# Altium project Project-C_VOLTAGE.PrjPCB (part 4 of 6)
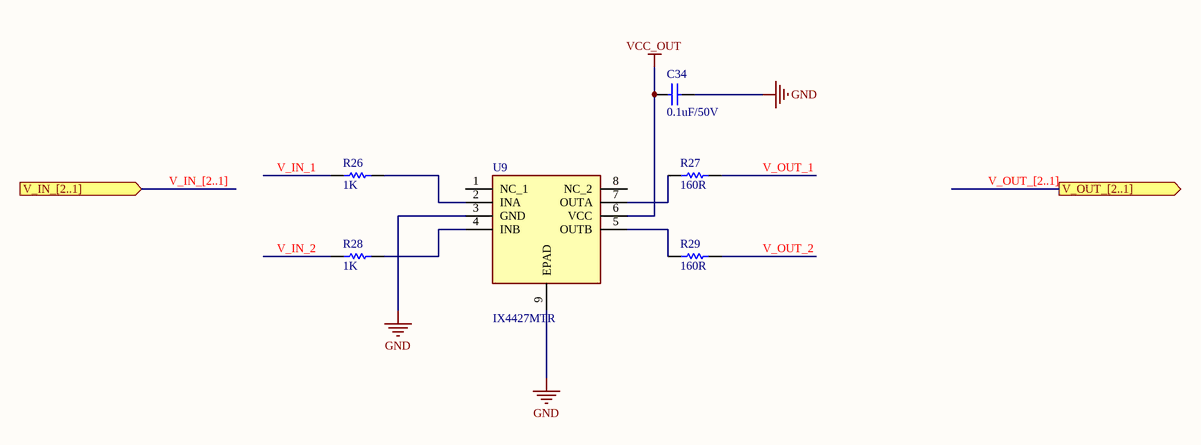
[diagram p11: VoltageAmplifier.SchDoc]

## Nets that join several sheets (continued)
VCC_OUT: POWER_VOLTAGE (6 pins), U_VoltageAmplifier_1xFPGA1/U_VoltageAmplifier1 (C34_U_VoltageAmplifier_1xFPGA1_U_VoltageAmplifier1.1 U9_U_VoltageAmplifier_1xFPGA1_U_VoltageAmplifier1.6), U_VoltageAmplifier_1xFPGA1/U_VoltageAmplifier2 (C34_U_VoltageAmplifier_1xFPGA1_U_VoltageAmplifier2.1 U9_U_VoltageAmplifier_1xFPGA1_U_VoltageAmplifier2.6), U_VoltageAmplifier_1xFPGA1/U_VoltageAmplifier3 (C34_U_VoltageAmplifier_1xFPGA1_U_VoltageAmplifier3.1 U9_U_VoltageAmplifier_1xFPGA1_U_VoltageAmplifier3.6), U_VoltageAmplifier_1xFPGA1/U_VoltageAmplifier4 (C34_U_VoltageAmplifier_1xFPGA1_U_VoltageAmplifier4.1 U9_U_VoltageAmplifier_1xFPGA1_U_VoltageAmplifier4.6), U_VoltageAmplifier_1xFPGA1/U_VoltageAmplifier5 (C34_U_VoltageAmplifier_1xFPGA1_U_VoltageAmplifier5.1 U9_U_VoltageAmplifier_1xFPGA1_U_VoltageAmplifier5.6), U_VoltageAmplifier_1xFPGA1/U_VoltageAmplifier6 (C34_U_VoltageAmplifier_1xFPGA1_U_VoltageAmplifier6.1 U9_U_VoltageAmplifier_1xFPGA1_U_VoltageAmplifier6.6), U_VoltageAmplifier_1xFPGA1/U_VoltageAmplifier7 (C34_U_VoltageAmplifier_1xFPGA1_U_VoltageAmplifier7.1 U9_U_VoltageAmplifier_1xFPGA1_U_VoltageAmplifier7.6), U_VoltageAmplifier_1xFPGA1/U_VoltageAmplifier8 (C34_U_VoltageAmplifier_1xFPGA1_U_VoltageAmplifier8.1 U9_U_VoltageAmplifier_1xFPGA1_U_VoltageAmplifier8.6), U_VoltageAmplifier_1xFPGA1/U_VoltageAmplifier9 (C34_U_VoltageAmplifier_1xFPGA1_U_VoltageAmplifier9.1 U9_U_VoltageAmplifier_1xFPGA1_U_VoltageAmplifier9.6), U_VoltageAmplifier_1xFPGA1/U_VoltageAmplifier10 (C34_U_VoltageAmplifier_1xFPGA1_U_VoltageAmplifier10.1 U9_U_VoltageAmplifier_1xFPGA1_U_VoltageAmplifier10.6), U_VoltageAmplifier_1xFPGA1/U_VoltageAmplifier11 (C34_U_VoltageAmplifier_1xFPGA1_U_VoltageAmplifier11.1 U9_U_VoltageAmplifier_1xFPGA1_U_VoltageAmplifier11.6), U_VoltageAmplifier_1xFPGA1/U_VoltageAmplifier12 (C34_U_VoltageAmplifier_1xFPGA1_U_VoltageAmplifier12.1 U9_U_VoltageAmplifier_1xFPGA1_U_VoltageAmplifier12.6), U_VoltageAmplifier_1xFPGA1/U_VoltageAmplifier13 (C34_U_VoltageAmplifier_1xFPGA1_U_VoltageAmplifier13.1 U9_U_VoltageAmplifier_1xFPGA1_U_VoltageAmplifier13.6), U_VoltageAmplifier_1xFPGA1/U_VoltageAmplifier14 (C34_U_VoltageAmplifier_1xFPGA1_U_VoltageAmplifier14.1 U9_U_VoltageAmplifier_1xFPGA1_U_VoltageAmplifier14.6), U_VoltageAmplifier_1xFPGA1/U_VoltageAmplifier15 (C34_U_VoltageAmplifier_1xFPGA1_U_VoltageAmplifier15.1 U9_U_VoltageAmplifier_1xFPGA1_U_VoltageAmplifier15.6), U_VoltageAmplifier_1xFPGA1/U_VoltageAmplifier16 (C34_U_VoltageAmplifier_1xFPGA1_U_VoltageAmplifier16.1 U9_U_VoltageAmplifier_1xFPGA1_U_VoltageAmplifier16.6), U_VoltageAmplifier_1xFPGA1/U_VoltageAmplifier17 (C34_U_VoltageAmplifier_1xFPGA1_U_VoltageAmplifier17.1 U9_U_VoltageAmplifier_1xFPGA1_U_VoltageAmplifier17.6), U_VoltageAmplifier_1xFPGA1/U_VoltageAmplifier18 (C34_U_VoltageAmplifier_1xFPGA1_U_VoltageAmplifier18.1 U9_U_VoltageAmplifier_1xFPGA1_U_VoltageAmplifier18.6), U_VoltageAmplifier_1xFPGA1/U_VoltageAmplifier19 (C34_U_VoltageAmplifier_1xFPGA1_U_VoltageAmplifier19.1 U9_U_VoltageAmplifier_1xFPGA1_U_VoltageAmplifier19.6), U_VoltageAmplifier_1xFPGA1/U_VoltageAmplifier20 (C34_U_VoltageAmplifier_1xFPGA1_U_VoltageAmplifier20.1 U9_U_VoltageAmplifier_1xFPGA1_U_VoltageAmplifier20.6), U_VoltageAmplifier_1xFPGA1/U_VoltageAmplifier21 (C34_U_VoltageAmplifier_1xFPGA1_U_VoltageAmplifier21.1 U9_U_VoltageAmplifier_1xFPGA1_U_VoltageAmplifier21.6), U_VoltageAmplifier_1xFPGA1/U_VoltageAmplifier22 (C34_U_VoltageAmplifier_1xFPGA1_U_VoltageAmplifier22.1 U9_U_VoltageAmplifier_1xFPGA1_U_VoltageAmplifier22.6), U_VoltageAmplifier_1xFPGA1/U_VoltageAmplifier23 (C34_U_VoltageAmplifier_1xFPGA1_U_VoltageAmplifier23.1 U9_U_VoltageAmplifier_1xFPGA1_U_VoltageAmplifier23.6), U_VoltageAmplifier_1xFPGA1/U_VoltageAmplifier24 (C34_U_VoltageAmplifier_1xFPGA1_U_VoltageAmplifier24.1 U9_U_VoltageAmplifier_1xFPGA1_U_VoltageAmplifier24.6), U_VoltageAmplifier_1xFPGA1/U_VoltageAmplifier25 (C34_U_VoltageAmplifier_1xFPGA1_U_VoltageAmplifier25.1 U9_U_VoltageAmplifier_1xFPGA1_U_VoltageAmplifier25.6), U_VoltageAmplifier_1xFPGA1/U_VoltageAmplifier26 (C34_U_VoltageAmplifier_1xFPGA1_U_VoltageAmplifier26.1 U9_U_VoltageAmplifier_1xFPGA1_U_VoltageAmplifier26.6), U_VoltageAmplifier_1xFPGA1/U_VoltageAmplifier27 (C34_U_VoltageAmplifier_1xFPGA1_U_VoltageAmplifier27.1 U9_U_VoltageAmplifier_1xFPGA1_U_VoltageAmplifier27.6), U_VoltageAmplifier_1xFPGA1/U_VoltageAmplifier28 (C34_U_VoltageAmplifier_1xFPGA1_U_VoltageAmplifier28.1 U9_U_VoltageAmplifier_1xFPGA1_U_VoltageAmplifier28.6), U_VoltageAmplifier_1xFPGA1/U_VoltageAmplifier29 (C34_U_VoltageAmplifier_1xFPGA1_U_VoltageAmplifier29.1 U9_U_VoltageAmplifier_1xFPGA1_U_VoltageAmplifier29.6), U_VoltageAmplifier_1xFPGA1/U_VoltageAmplifier30 (C34_U_VoltageAmplifier_1xFPGA1_U_VoltageAmplifier30.1 U9_U_VoltageAmplifier_1xFPGA1_U_VoltageAmplifier30.6), U_VoltageAmplifier_1xFPGA1/U_VoltageAmplifier31 (C34_U_VoltageAmplifier_1xFPGA1_U_VoltageAmplifier31.1 U9_U_VoltageAmplifier_1xFPGA1_U_VoltageAmplifier31.6), U_VoltageAmplifier_1xFPGA1/U_VoltageAmplifier32 (C34_U_VoltageAmplifier_1xFPGA1_U_VoltageAmplifier32.1 U9_U_VoltageAmplifier_1xFPGA1_U_VoltageAmplifier32.6), U_VoltageAmplifier_1xFPGA1/U_VoltageAmplifier33 (C34_U_VoltageAmplifier_1xFPGA1_U_VoltageAmplifier33.1 U9_U_VoltageAmplifier_1xFPGA1_U_VoltageAmplifier33.6), U_VoltageAmplifier_1xFPGA1/U_VoltageAmplifier34 (C34_U_VoltageAmplifier_1xFPGA1_U_VoltageAmplifier34.1 U9_U_VoltageAmplifier_1xFPGA1_U_VoltageAmplifier34.6), U_VoltageAmplifier_1xFPGA1/U_VoltageAmplifier35 (C34_U_VoltageAmplifier_1xFPGA1_U_VoltageAmplifier35.1 U9_U_VoltageAmplifier_1xFPGA1_U_VoltageAmplifier35.6), U_VoltageAmplifier_1xFPGA1/U_VoltageAmplifier36 (C34_U_VoltageAmplifier_1xFPGA1_U_VoltageAmplifier36.1 U9_U_VoltageAmplifier_1xFPGA1_U_VoltageAmplifier36.6), U_VoltageAmplifier_1xFPGA1/U_VoltageAmplifier37 (C34_U_VoltageAmplifier_1xFPGA1_U_VoltageAmplifier37.1 U9_U_VoltageAmplifier_1xFPGA1_U_VoltageAmplifier37.6), U_VoltageAmplifier_1xFPGA1/U_VoltageAmplifier38 (C34_U_VoltageAmplifier_1xFPGA1_U_VoltageAmplifier38.1 U9_U_VoltageAmplifier_1xFPGA1_U_VoltageAmplifier38.6), U_VoltageAmplifier_1xFPGA2/U_VoltageAmplifier1 (C34_U_VoltageAmplifier_1xFPGA2_U_VoltageAmplifier1.1 U9_U_VoltageAmplifier_1xFPGA2_U_VoltageAmplifier1.6), U_VoltageAmplifier_1xFPGA2/U_VoltageAmplifier2 (C34_U_VoltageAmplifier_1xFPGA2_U_VoltageAmplifier2.1 U9_U_VoltageAmplifier_1xFPGA2_U_VoltageAmplifier2.6), U_VoltageAmplifier_1xFPGA2/U_VoltageAmplifier3 (C34_U_VoltageAmplifier_1xFPGA2_U_VoltageAmplifier3.1 U9_U_VoltageAmplifier_1xFPGA2_U_VoltageAmplifier3.6), U_VoltageAmplifier_1xFPGA2/U_VoltageAmplifier4 (C34_U_VoltageAmplifier_1xFPGA2_U_VoltageAmplifier4.1 U9_U_VoltageAmplifier_1xFPGA2_U_VoltageAmplifier4.6), U_VoltageAmplifier_1xFPGA2/U_VoltageAmplifier5 (C34_U_VoltageAmplifier_1xFPGA2_U_VoltageAmplifier5.1 U9_U_VoltageAmplifier_1xFPGA2_U_VoltageAmplifier5.6), U_VoltageAmplifier_1xFPGA2/U_VoltageAmplifier6 (C34_U_VoltageAmplifier_1xFPGA2_U_VoltageAmplifier6.1 U9_U_VoltageAmplifier_1xFPGA2_U_VoltageAmplifier6.6), U_VoltageAmplifier_1xFPGA2/U_VoltageAmplifier7 (C34_U_VoltageAmplifier_1xFPGA2_U_VoltageAmplifier7.1 U9_U_VoltageAmplifier_1xFPGA2_U_VoltageAmplifier7.6), U_VoltageAmplifier_1xFPGA2/U_VoltageAmplifier8 (C34_U_VoltageAmplifier_1xFPGA2_U_VoltageAmplifier8.1 U9_U_VoltageAmplifier_1xFPGA2_U_VoltageAmplifier8.6), U_VoltageAmplifier_1xFPGA2/U_VoltageAmplifier9 (C34_U_VoltageAmplifier_1xFPGA2_U_VoltageAmplifier9.1 U9_U_VoltageAmplifier_1xFPGA2_U_VoltageAmplifier9.6), U_VoltageAmplifier_1xFPGA2/U_VoltageAmplifier10 (C34_U_VoltageAmplifier_1xFPGA2_U_VoltageAmplifier10.1 U9_U_VoltageAmplifier_1xFPGA2_U_VoltageAmplifier10.6), U_VoltageAmplifier_1xFPGA2/U_VoltageAmplifier11 (C34_U_VoltageAmplifier_1xFPGA2_U_VoltageAmplifier11.1 U9_U_VoltageAmplifier_1xFPGA2_U_VoltageAmplifier11.6), U_VoltageAmplifier_1xFPGA2/U_VoltageAmplifier12 (C34_U_VoltageAmplifier_1xFPGA2_U_VoltageAmplifier12.1 U9_U_VoltageAmplifier_1xFPGA2_U_VoltageAmplifier12.6), U_VoltageAmplifier_1xFPGA2/U_VoltageAmplifier13 (C34_U_VoltageAmplifier_1xFPGA2_U_VoltageAmplifier13.1 U9_U_VoltageAmplifier_1xFPGA2_U_VoltageAmplifier13.6), U_VoltageAmplifier_1xFPGA2/U_VoltageAmplifier14 (C34_U_VoltageAmplifier_1xFPGA2_U_VoltageAmplifier14.1 U9_U_VoltageAmplifier_1xFPGA2_U_VoltageAmplifier14.6), U_VoltageAmplifier_1xFPGA2/U_VoltageAmplifier15 (C34_U_VoltageAmplifier_1xFPGA2_U_VoltageAmplifier15.1 U9_U_VoltageAmplifier_1xFPGA2_U_VoltageAmplifier15.6), U_VoltageAmplifier_1xFPGA2/U_VoltageAmplifier16 (C34_U_VoltageAmplifier_1xFPGA2_U_VoltageAmplifier16.1 U9_U_VoltageAmplifier_1xFPGA2_U_VoltageAmplifier16.6), U_VoltageAmplifier_1xFPGA2/U_VoltageAmplifier17 (C34_U_VoltageAmplifier_1xFPGA2_U_VoltageAmplifier17.1 U9_U_VoltageAmplifier_1xFPGA2_U_VoltageAmplifier17.6), U_VoltageAmplifier_1xFPGA2/U_VoltageAmplifier18 (C34_U_VoltageAmplifier_1xFPGA2_U_VoltageAmplifier18.1 U9_U_VoltageAmplifier_1xFPGA2_U_VoltageAmplifier18.6), U_VoltageAmplifier_1xFPGA2/U_VoltageAmplifier19 (C34_U_VoltageAmplifier_1xFPGA2_U_VoltageAmplifier19.1 U9_U_VoltageAmplifier_1xFPGA2_U_VoltageAmplifier19.6), U_VoltageAmplifier_1xFPGA2/U_VoltageAmplifier20 (C34_U_VoltageAmplifier_1xFPGA2_U_VoltageAmplifier20.1 U9_U_VoltageAmplifier_1xFPGA2_U_VoltageAmplifier20.6), U_VoltageAmplifier_1xFPGA2/U_VoltageAmplifier21 (C34_U_VoltageAmplifier_1xFPGA2_U_VoltageAmplifier21.1 U9_U_VoltageAmplifier_1xFPGA2_U_VoltageAmplifier21.6), U_VoltageAmplifier_1xFPGA2/U_VoltageAmplifier22 (C34_U_VoltageAmplifier_1xFPGA2_U_VoltageAmplifier22.1 U9_U_VoltageAmplifier_1xFPGA2_U_VoltageAmplifier22.6), U_VoltageAmplifier_1xFPGA2/U_VoltageAmplifier23 (C34_U_VoltageAmplifier_1xFPGA2_U_VoltageAmplifier23.1 U9_U_VoltageAmplifier_1xFPGA2_U_VoltageAmplifier23.6), U_VoltageAmplifier_1xFPGA2/U_VoltageAmplifier24 (C34_U_VoltageAmplifier_1xFPGA2_U_VoltageAmplifier24.1 U9_U_VoltageAmplifier_1xFPGA2_U_VoltageAmplifier24.6), U_VoltageAmplifier_1xFPGA2/U_VoltageAmplifier25 (C34_U_VoltageAmplifier_1xFPGA2_U_VoltageAmplifier25.1 U9_U_VoltageAmplifier_1xFPGA2_U_VoltageAmplifier25.6), U_VoltageAmplifier_1xFPGA2/U_VoltageAmplifier26 (C34_U_VoltageAmplifier_1xFPGA2_U_VoltageAmplifier26.1 U9_U_VoltageAmplifier_1xFPGA2_U_VoltageAmplifier26.6), U_VoltageAmplifier_1xFPGA2/U_VoltageAmplifier27 (C34_U_VoltageAmplifier_1xFPGA2_U_VoltageAmplifier27.1 U9_U_VoltageAmplifier_1xFPGA2_U_VoltageAmplifier27.6), U_VoltageAmplifier_1xFPGA2/U_VoltageAmplifier28 (C34_U_VoltageAmplifier_1xFPGA2_U_VoltageAmplifier28.1 U9_U_VoltageAmplifier_1xFPGA2_U_VoltageAmplifier28.6), U_VoltageAmplifier_1xFPGA2/U_VoltageAmplifier29 (C34_U_VoltageAmplifier_1xFPGA2_U_VoltageAmplifier29.1 U9_U_VoltageAmplifier_1xFPGA2_U_VoltageAmplifier29.6), U_VoltageAmplifier_1xFPGA2/U_VoltageAmplifier30 (C34_U_VoltageAmplifier_1xFPGA2_U_VoltageAmplifier30.1 U9_U_VoltageAmplifier_1xFPGA2_U_VoltageAmplifier30.6), U_VoltageAmplifier_1xFPGA2/U_VoltageAmplifier31 (C34_U_VoltageAmplifier_1xFPGA2_U_VoltageAmplifier31.1 U9_U_VoltageAmplifier_1xFPGA2_U_VoltageAmplifier31.6), U_VoltageAmplifier_1xFPGA2/U_VoltageAmplifier32 (C34_U_VoltageAmplifier_1xFPGA2_U_VoltageAmplifier32.1 U9_U_VoltageAmplifier_1xFPGA2_U_VoltageAmplifier32.6), U_VoltageAmplifier_1xFPGA2/U_VoltageAmplifier33 (C34_U_VoltageAmplifier_1xFPGA2_U_VoltageAmplifier33.1 U9_U_VoltageAmplifier_1xFPGA2_U_VoltageAmplifier33.6), U_VoltageAmplifier_1xFPGA2/U_VoltageAmplifier34 (C34_U_VoltageAmplifier_1xFPGA2_U_VoltageAmplifier34.1 U9_U_VoltageAmplifier_1xFPGA2_U_VoltageAmplifier34.6), U_VoltageAmplifier_1xFPGA2/U_VoltageAmplifier35 (C34_U_VoltageAmplifier_1xFPGA2_U_VoltageAmplifier35.1 U9_U_VoltageAmplifier_1xFPGA2_U_VoltageAmplifier35.6), U_VoltageAmplifier_1xFPGA2/U_VoltageAmplifier36 (C34_U_VoltageAmplifier_1xFPGA2_U_VoltageAmplifier36.1 U9_U_VoltageAmplifier_1xFPGA2_U_VoltageAmplifier36.6), U_VoltageAmplifier_1xFPGA2/U_VoltageAmplifier37 (C34_U_VoltageAmplifier_1xFPGA2_U_VoltageAmplifier37.1 U9_U_VoltageAmplifier_1xFPGA2_U_VoltageAmplifier37.6), U_VoltageAmplifier_1xFPGA2/U_VoltageAmplifier38 (C34_U_VoltageAmplifier_1xFPGA2_U_VoltageAmplifier38.1 U9_U_VoltageAmplifier_1xFPGA2_U_VoltageAmplifier38.6), U_VoltageAmplifier_1xFPGA3/U_VoltageAmplifier1 (C34_U_VoltageAmplifier_1xFPGA3_U_VoltageAmplifier1.1 U9_U_VoltageAmplifier_1xFPGA3_U_VoltageAmplifier1.6), U_VoltageAmplifier_1xFPGA3/U_VoltageAmplifier2 (C34_U_VoltageAmplifier_1xFPGA3_U_VoltageAmplifier2.1 U9_U_VoltageAmplifier_1xFPGA3_U_VoltageAmplifier2.6), U_VoltageAmplifier_1xFPGA3/U_VoltageAmplifier3 (C34_U_VoltageAmplifier_1xFPGA3_U_VoltageAmplifier3.1 U9_U_VoltageAmplifier_1xFPGA3_U_VoltageAmplifier3.6), U_VoltageAmplifier_1xFPGA3/U_VoltageAmplifier4 (C34_U_VoltageAmplifier_1xFPGA3_U_VoltageAmplifier4.1 U9_U_VoltageAmplifier_1xFPGA3_U_VoltageAmplifier4.6), U_VoltageAmplifier_1xFPGA3/U_VoltageAmplifier5 (C34_U_VoltageAmplifier_1xFPGA3_U_VoltageAmplifier5.1 U9_U_VoltageAmplifier_1xFPGA3_U_VoltageAmplifier5.6), U_VoltageAmplifier_1xFPGA3/U_VoltageAmplifier6 (C34_U_VoltageAmplifier_1xFPGA3_U_VoltageAmplifier6.1 U9_U_VoltageAmplifier_1xFPGA3_U_VoltageAmplifier6.6), U_VoltageAmplifier_1xFPGA3/U_VoltageAmplifier7 (C34_U_VoltageAmplifier_1xFPGA3_U_VoltageAmplifier7.1 U9_U_VoltageAmplifier_1xFPGA3_U_VoltageAmplifier7.6), U_VoltageAmplifier_1xFPGA3/U_VoltageAmplifier8 (C34_U_VoltageAmplifier_1xFPGA3_U_VoltageAmplifier8.1 U9_U_VoltageAmplifier_1xFPGA3_U_VoltageAmplifier8.6), U_VoltageAmplifier_1xFPGA3/U_VoltageAmplifier9 (C34_U_VoltageAmplifier_1xFPGA3_U_VoltageAmplifier9.1 U9_U_VoltageAmplifier_1xFPGA3_U_VoltageAmplifier9.6), U_VoltageAmplifier_1xFPGA3/U_VoltageAmplifier10 (C34_U_VoltageAmplifier_1xFPGA3_U_VoltageAmplifier10.1 U9_U_VoltageAmplifier_1xFPGA3_U_VoltageAmplifier10.6), U_VoltageAmplifier_1xFPGA3/U_VoltageAmplifier11 (C34_U_VoltageAmplifier_1xFPGA3_U_VoltageAmplifier11.1 U9_U_VoltageAmplifier_1xFPGA3_U_VoltageAmplifier11.6), U_VoltageAmplifier_1xFPGA3/U_VoltageAmplifier12 (C34_U_VoltageAmplifier_1xFPGA3_U_VoltageAmplifier12.1 U9_U_VoltageAmplifier_1xFPGA3_U_VoltageAmplifier12.6), U_VoltageAmplifier_1xFPGA3/U_VoltageAmplifier13 (C34_U_VoltageAmplifier_1xFPGA3_U_VoltageAmplifier13.1 U9_U_VoltageAmplifier_1xFPGA3_U_VoltageAmplifier13.6), U_VoltageAmplifier_1xFPGA3/U_VoltageAmplifier14 (C34_U_VoltageAmplifier_1xFPGA3_U_VoltageAmplifier14.1 U9_U_VoltageAmplifier_1xFPGA3_U_VoltageAmplifier14.6), U_VoltageAmplifier_1xFPGA3/U_VoltageAmplifier15 (C34_U_VoltageAmplifier_1xFPGA3_U_VoltageAmplifier15.1 U9_U_VoltageAmplifier_1xFPGA3_U_VoltageAmplifier15.6), U_VoltageAmplifier_1xFPGA3/U_VoltageAmplifier16 (C34_U_VoltageAmplifier_1xFPGA3_U_VoltageAmplifier16.1 U9_U_VoltageAmplifier_1xFPGA3_U_VoltageAmplifier16.6), U_VoltageAmplifier_1xFPGA3/U_VoltageAmplifier17 (C34_U_VoltageAmplifier_1xFPGA3_U_VoltageAmplifier17.1 U9_U_VoltageAmplifier_1xFPGA3_U_VoltageAmplifier17.6), U_VoltageAmplifier_1xFPGA3/U_VoltageAmplifier18 (C34_U_VoltageAmplifier_1xFPGA3_U_VoltageAmplifier18.1 U9_U_VoltageAmplifier_1xFPGA3_U_VoltageAmplifier18.6), U_VoltageAmplifier_1xFPGA3/U_VoltageAmplifier19 (C34_U_VoltageAmplifier_1xFPGA3_U_VoltageAmplifier19.1 U9_U_VoltageAmplifier_1xFPGA3_U_VoltageAmplifier19.6), U_VoltageAmplifier_1xFPGA3/U_VoltageAmplifier20 (C34_U_VoltageAmplifier_1xFPGA3_U_VoltageAmplifier20.1 U9_U_VoltageAmplifier_1xFPGA3_U_VoltageAmplifier20.6), U_VoltageAmplifier_1xFPGA3/U_VoltageAmplifier21 (C34_U_VoltageAmplifier_1xFPGA3_U_VoltageAmplifier21.1 U9_U_VoltageAmplifier_1xFPGA3_U_VoltageAmplifier21.6), U_VoltageAmplifier_1xFPGA3/U_VoltageAmplifier22 (C34_U_VoltageAmplifier_1xFPGA3_U_VoltageAmplifier22.1 U9_U_VoltageAmplifier_1xFPGA3_U_VoltageAmplifier22.6), U_VoltageAmplifier_1xFPGA3/U_VoltageAmplifier23 (C34_U_VoltageAmplifier_1xFPGA3_U_VoltageAmplifier23.1 U9_U_VoltageAmplifier_1xFPGA3_U_VoltageAmplifier23.6), U_VoltageAmplifier_1xFPGA3/U_VoltageAmplifier24 (C34_U_VoltageAmplifier_1xFPGA3_U_VoltageAmplifier24.1 U9_U_VoltageAmplifier_1xFPGA3_U_VoltageAmplifier24.6), U_VoltageAmplifier_1xFPGA3/U_VoltageAmplifier25 (C34_U_VoltageAmplifier_1xFPGA3_U_VoltageAmplifier25.1 U9_U_VoltageAmplifier_1xFPGA3_U_VoltageAmplifier25.6), U_VoltageAmplifier_1xFPGA3/U_VoltageAmplifier26 (C34_U_VoltageAmplifier_1xFPGA3_U_VoltageAmplifier26.1 U9_U_VoltageAmplifier_1xFPGA3_U_VoltageAmplifier26.6), U_VoltageAmplifier_1xFPGA3/U_VoltageAmplifier27 (C34_U_VoltageAmplifier_1xFPGA3_U_VoltageAmplifier27.1 U9_U_VoltageAmplifier_1xFPGA3_U_VoltageAmplifier27.6), U_VoltageAmplifier_1xFPGA3/U_VoltageAmplifier28 (C34_U_VoltageAmplifier_1xFPGA3_U_VoltageAmplifier28.1 U9_U_VoltageAmplifier_1xFPGA3_U_VoltageAmplifier28.6), U_VoltageAmplifier_1xFPGA3/U_VoltageAmplifier29 (C34_U_VoltageAmplifier_1xFPGA3_U_VoltageAmplifier29.1 U9_U_VoltageAmplifier_1xFPGA3_U_VoltageAmplifier29.6), U_VoltageAmplifier_1xFPGA3/U_VoltageAmplifier30 (C34_U_VoltageAmplifier_1xFPGA3_U_VoltageAmplifier30.1 U9_U_VoltageAmplifier_1xFPGA3_U_VoltageAmplifier30.6), U_VoltageAmplifier_1xFPGA3/U_VoltageAmplifier31 (C34_U_VoltageAmplifier_1xFPGA3_U_VoltageAmplifier31.1 U9_U_VoltageAmplifier_1xFPGA3_U_VoltageAmplifier31.6), U_VoltageAmplifier_1xFPGA3/U_VoltageAmplifier32 (C34_U_VoltageAmplifier_1xFPGA3_U_VoltageAmplifier32.1 U9_U_VoltageAmplifier_1xFPGA3_U_VoltageAmplifier32.6), U_VoltageAmplifier_1xFPGA3/U_VoltageAmplifier33 (C34_U_VoltageAmplifier_1xFPGA3_U_VoltageAmplifier33.1 U9_U_VoltageAmplifier_1xFPGA3_U_VoltageAmplifier33.6), U_VoltageAmplifier_1xFPGA3/U_VoltageAmplifier34 (C34_U_VoltageAmplifier_1xFPGA3_U_VoltageAmplifier34.1 U9_U_VoltageAmplifier_1xFPGA3_U_VoltageAmplifier34.6), U_VoltageAmplifier_1xFPGA3/U_VoltageAmplifier35 (C34_U_VoltageAmplifier_1xFPGA3_U_VoltageAmplifier35.1 U9_U_VoltageAmplifier_1xFPGA3_U_VoltageAmplifier35.6), U_VoltageAmplifier_1xFPGA3/U_VoltageAmplifier36 (C34_U_VoltageAmplifier_1xFPGA3_U_VoltageAmplifier36.1 U9_U_VoltageAmplifier_1xFPGA3_U_VoltageAmplifier36.6), U_VoltageAmplifier_1xFPGA3/U_VoltageAmplifier37 (C34_U_VoltageAmplifier_1xFPGA3_U_VoltageAmplifier37.1 U9_U_VoltageAmplifier_1xFPGA3_U_VoltageAmplifier37.6), U_VoltageAmplifier_1xFPGA3/U_VoltageAmplifier38 (C34_U_VoltageAmplifier_1xFPGA3_U_VoltageAmplifier38.1 U9_U_VoltageAmplifier_1xFPGA3_U_VoltageAmplifier38.6), U_VoltageAmplifier_1xFPGA4/U_VoltageAmplifier1 (C34_U_VoltageAmplifier_1xFPGA4_U_VoltageAmplifier1.1 U9_U_VoltageAmplifier_1xFPGA4_U_VoltageAmplifier1.6), U_VoltageAmplifier_1xFPGA4/U_VoltageAmplifier2 (C34_U_VoltageAmplifier_1xFPGA4_U_VoltageAmplifier2.1 U9_U_VoltageAmplifier_1xFPGA4_U_VoltageAmplifier2.6), U_VoltageAmplifier_1xFPGA4/U_VoltageAmplifier3 (C34_U_VoltageAmplifier_1xFPGA4_U_VoltageAmplifier3.1 U9_U_VoltageAmplifier_1xFPGA4_U_VoltageAmplifier3.6), U_VoltageAmplifier_1xFPGA4/U_VoltageAmplifier4 (C34_U_VoltageAmplifier_1xFPGA4_U_VoltageAmplifier4.1 U9_U_VoltageAmplifier_1xFPGA4_U_VoltageAmplifier4.6), U_VoltageAmplifier_1xFPGA4/U_VoltageAmplifier5 (C34_U_VoltageAmplifier_1xFPGA4_U_VoltageAmplifier5.1 U9_U_VoltageAmplifier_1xFPGA4_U_VoltageAmplifier5.6), U_VoltageAmplifier_1xFPGA4/U_VoltageAmplifier6 (C34_U_VoltageAmplifier_1xFPGA4_U_VoltageAmplifier6.1 U9_U_VoltageAmplifier_1xFPGA4_U_VoltageAmplifier6.6), U_VoltageAmplifier_1xFPGA4/U_VoltageAmplifier7 (C34_U_VoltageAmplifier_1xFPGA4_U_VoltageAmplifier7.1 U9_U_VoltageAmplifier_1xFPGA4_U_VoltageAmplifier7.6), U_VoltageAmplifier_1xFPGA4/U_VoltageAmplifier8 (C34_U_VoltageAmplifier_1xFPGA4_U_VoltageAmplifier8.1 U9_U_VoltageAmplifier_1xFPGA4_U_VoltageAmplifier8.6), U_VoltageAmplifier_1xFPGA4/U_VoltageAmplifier9 (C34_U_VoltageAmplifier_1xFPGA4_U_VoltageAmplifier9.1 U9_U_VoltageAmplifier_1xFPGA4_U_VoltageAmplifier9.6), U_VoltageAmplifier_1xFPGA4/U_VoltageAmplifier10 (C34_U_VoltageAmplifier_1xFPGA4_U_VoltageAmplifier10.1 U9_U_VoltageAmplifier_1xFPGA4_U_VoltageAmplifier10.6), U_VoltageAmplifier_1xFPGA4/U_VoltageAmplifier11 (C34_U_VoltageAmplifier_1xFPGA4_U_VoltageAmplifier11.1 U9_U_VoltageAmplifier_1xFPGA4_U_VoltageAmplifier11.6), U_VoltageAmplifier_1xFPGA4/U_VoltageAmplifier12 (C34_U_VoltageAmplifier_1xFPGA4_U_VoltageAmplifier12.1 U9_U_VoltageAmplifier_1xFPGA4_U_VoltageAmplifier12.6), U_VoltageAmplifier_1xFPGA4/U_VoltageAmplifier13 (C34_U_VoltageAmplifier_1xFPGA4_U_VoltageAmplifier13.1 U9_U_VoltageAmplifier_1xFPGA4_U_VoltageAmplifier13.6), U_VoltageAmplifier_1xFPGA4/U_VoltageAmplifier14 (C34_U_VoltageAmplifier_1xFPGA4_U_VoltageAmplifier14.1 U9_U_VoltageAmplifier_1xFPGA4_U_VoltageAmplifier14.6), U_VoltageAmplifier_1xFPGA4/U_VoltageAmplifier15 (C34_U_VoltageAmplifier_1xFPGA4_U_VoltageAmplifier15.1 U9_U_VoltageAmplifier_1xFPGA4_U_VoltageAmplifier15.6), U_VoltageAmplifier_1xFPGA4/U_VoltageAmplifier16 (C34_U_VoltageAmplifier_1xFPGA4_U_VoltageAmplifier16.1 U9_U_VoltageAmplifier_1xFPGA4_U_VoltageAmplifier16.6), U_VoltageAmplifier_1xFPGA4/U_VoltageAmplifier17 (C34_U_VoltageAmplifier_1xFPGA4_U_VoltageAmplifier17.1 U9_U_VoltageAmplifier_1xFPGA4_U_VoltageAmplifier17.6), U_VoltageAmplifier_1xFPGA4/U_VoltageAmplifier18 (C34_U_VoltageAmplifier_1xFPGA4_U_VoltageAmplifier18.1 U9_U_VoltageAmplifier_1xFPGA4_U_VoltageAmplifier18.6), U_VoltageAmplifier_1xFPGA4/U_VoltageAmplifier19 (C34_U_VoltageAmplifier_1xFPGA4_U_VoltageAmplifier19.1 U9_U_VoltageAmplifier_1xFPGA4_U_VoltageAmplifier19.6), U_VoltageAmplifier_1xFPGA4/U_VoltageAmplifier20 (C34_U_VoltageAmplifier_1xFPGA4_U_VoltageAmplifier20.1 U9_U_VoltageAmplifier_1xFPGA4_U_VoltageAmplifier20.6), U_VoltageAmplifier_1xFPGA4/U_VoltageAmplifier21 (C34_U_VoltageAmplifier_1xFPGA4_U_VoltageAmplifier21.1 U9_U_VoltageAmplifier_1xFPGA4_U_VoltageAmplifier21.6), U_VoltageAmplifier_1xFPGA4/U_VoltageAmplifier22 (C34_U_VoltageAmplifier_1xFPGA4_U_VoltageAmplifier22.1 U9_U_VoltageAmplifier_1xFPGA4_U_VoltageAmplifier22.6), U_VoltageAmplifier_1xFPGA4/U_VoltageAmplifier23 (C34_U_VoltageAmplifier_1xFPGA4_U_VoltageAmplifier23.1 U9_U_VoltageAmplifier_1xFPGA4_U_VoltageAmplifier23.6), U_VoltageAmplifier_1xFPGA4/U_VoltageAmplifier24 (C34_U_VoltageAmplifier_1xFPGA4_U_VoltageAmplifier24.1 U9_U_VoltageAmplifier_1xFPGA4_U_VoltageAmplifier24.6), U_VoltageAmplifier_1xFPGA4/U_VoltageAmplifier25 (C34_U_VoltageAmplifier_1xFPGA4_U_VoltageAmplifier25.1 U9_U_VoltageAmplifier_1xFPGA4_U_VoltageAmplifier25.6), U_VoltageAmplifier_1xFPGA4/U_VoltageAmplifier26 (C34_U_VoltageAmplifier_1xFPGA4_U_VoltageAmplifier26.1 U9_U_VoltageAmplifier_1xFPGA4_U_VoltageAmplifier26.6), U_VoltageAmplifier_1xFPGA4/U_VoltageAmplifier27 (C34_U_VoltageAmplifier_1xFPGA4_U_VoltageAmplifier27.1 U9_U_VoltageAmplifier_1xFPGA4_U_VoltageAmplifier27.6), U_VoltageAmplifier_1xFPGA4/U_VoltageAmplifier28 (C34_U_VoltageAmplifier_1xFPGA4_U_VoltageAmplifier28.1 U9_U_VoltageAmplifier_1xFPGA4_U_VoltageAmplifier28.6), U_VoltageAmplifier_1xFPGA4/U_VoltageAmplifier29 (C34_U_VoltageAmplifier_1xFPGA4_U_VoltageAmplifier29.1 U9_U_VoltageAmplifier_1xFPGA4_U_VoltageAmplifier29.6), U_VoltageAmplifier_1xFPGA4/U_VoltageAmplifier30 (C34_U_VoltageAmplifier_1xFPGA4_U_VoltageAmplifier30.1 U9_U_VoltageAmplifier_1xFPGA4_U_VoltageAmplifier30.6), U_VoltageAmplifier_1xFPGA4/U_VoltageAmplifier31 (C34_U_VoltageAmplifier_1xFPGA4_U_VoltageAmplifier31.1 U9_U_VoltageAmplifier_1xFPGA4_U_VoltageAmplifier31.6), U_VoltageAmplifier_1xFPGA4/U_VoltageAmplifier32 (C34_U_VoltageAmplifier_1xFPGA4_U_VoltageAmplifier32.1 U9_U_VoltageAmplifier_1xFPGA4_U_VoltageAmplifier32.6), U_VoltageAmplifier_1xFPGA4/U_VoltageAmplifier33 (C34_U_VoltageAmplifier_1xFPGA4_U_VoltageAmplifier33.1 U9_U_VoltageAmplifier_1xFPGA4_U_VoltageAmplifier33.6), U_VoltageAmplifier_1xFPGA4/U_VoltageAmplifier34 (C34_U_VoltageAmplifier_1xFPGA4_U_VoltageAmplifier34.1 U9_U_VoltageAmplifier_1xFPGA4_U_VoltageAmplifier34.6), U_VoltageAmplifier_1xFPGA4/U_VoltageAmplifier35 (C34_U_VoltageAmplifier_1xFPGA4_U_VoltageAmplifier35.1 U9_U_VoltageAmplifier_1xFPGA4_U_VoltageAmplifier35.6), U_VoltageAmplifier_1xFPGA4/U_VoltageAmplifier36 (C34_U_VoltageAmplifier_1xFPGA4_U_VoltageAmplifier36.1 U9_U_VoltageAmplifier_1xFPGA4_U_VoltageAmplifier36.6), U_VoltageAmplifier_1xFPGA4/U_VoltageAmplifier37 (C34_U_VoltageAmplifier_1xFPGA4_U_VoltageAmplifier37.1 U9_U_VoltageAmplifier_1xFPGA4_U_VoltageAmplifier37.6), U_VoltageAmplifier_1xFPGA4/U_VoltageAmplifier38 (C34_U_VoltageAmplifier_1xFPGA4_U_VoltageAmplifier38.1 U9_U_VoltageAmplifier_1xFPGA4_U_VoltageAmplifier38.6)
BANK_EN0: TOP_VOLTAGE (U14.11), F1/IO (P1_F1_IO.17)
BANK_EN1: TOP_VOLTAGE (U14.10), F1/IO (P1_F1_IO.30)
BANK_EN2: F1/IO (P1_F1_IO.48), POWER_VOLTAGE (R22.2 U15.4)
CMD_INT: F1/IO (P1_F1_IO.61), F2/IO (P1_F2_IO.61), F3/IO (P1_F3_IO.61), F4/IO (P1_F4_IO.61)
CMD_RX: TOP_VOLTAGE (U2.9), F1/IO (P1_F1_IO.98), F2/IO (P1_F2_IO.98), F3/IO (P1_F3_IO.98), F4/IO (P1_F4_IO.98)
CMD_TX: TOP_VOLTAGE (U14.1), F4/IO (P1_F4_IO.96)
CMD_TX: TOP_VOLTAGE (U14.2), F3/IO (P1_F3_IO.96)
CMD_TX: TOP_VOLTAGE (U14.3), F2/IO (P1_F2_IO.96)
CMD_TX: TOP_VOLTAGE (U14.4), F1/IO (P1_F1_IO.96)
GPIO_0: F1/IO (P1_F1_IO.14), U_VoltageAmplifier_1xFPGA1/U_VoltageAmplifier1 (R26_U_VoltageAmplifier_1xFPGA1_U_VoltageAmplifier1.1)
GPIO_0: F2/IO (P1_F2_IO.14), U_VoltageAmplifier_1xFPGA2/U_VoltageAmplifier1 (R26_U_VoltageAmplifier_1xFPGA2_U_VoltageAmplifier1.1)
GPIO_0: F3/IO (P1_F3_IO.14), U_VoltageAmplifier_1xFPGA3/U_VoltageAmplifier1 (R26_U_VoltageAmplifier_1xFPGA3_U_VoltageAmplifier1.1)
GPIO_0: F4/IO (P1_F4_IO.14), U_VoltageAmplifier_1xFPGA4/U_VoltageAmplifier1 (R26_U_VoltageAmplifier_1xFPGA4_U_VoltageAmplifier1.1)
GPIO_1: F1/IO (P1_F1_IO.11), U_VoltageAmplifier_1xFPGA1/U_VoltageAmplifier1 (R28_U_VoltageAmplifier_1xFPGA1_U_VoltageAmplifier1.1)
GPIO_1: F2/IO (P1_F2_IO.11), U_VoltageAmplifier_1xFPGA2/U_VoltageAmplifier1 (R28_U_VoltageAmplifier_1xFPGA2_U_VoltageAmplifier1.1)
GPIO_1: F3/IO (P1_F3_IO.11), U_VoltageAmplifier_1xFPGA3/U_VoltageAmplifier1 (R28_U_VoltageAmplifier_1xFPGA3_U_VoltageAmplifier1.1)
GPIO_1: F4/IO (P1_F4_IO.11), U_VoltageAmplifier_1xFPGA4/U_VoltageAmplifier1 (R28_U_VoltageAmplifier_1xFPGA4_U_VoltageAmplifier1.1)
GPIO_2: F1/IO (P1_F1_IO.12), U_VoltageAmplifier_1xFPGA1/U_VoltageAmplifier2 (R26_U_VoltageAmplifier_1xFPGA1_U_VoltageAmplifier2.1)
GPIO_2: F2/IO (P1_F2_IO.12), U_VoltageAmplifier_1xFPGA2/U_VoltageAmplifier2 (R26_U_VoltageAmplifier_1xFPGA2_U_VoltageAmplifier2.1)
GPIO_2: F3/IO (P1_F3_IO.12), U_VoltageAmplifier_1xFPGA3/U_VoltageAmplifier2 (R26_U_VoltageAmplifier_1xFPGA3_U_VoltageAmplifier2.1)
GPIO_2: F4/IO (P1_F4_IO.12), U_VoltageAmplifier_1xFPGA4/U_VoltageAmplifier2 (R26_U_VoltageAmplifier_1xFPGA4_U_VoltageAmplifier2.1)
GPIO_3: F1/IO (P1_F1_IO.13), U_VoltageAmplifier_1xFPGA1/U_VoltageAmplifier2 (R28_U_VoltageAmplifier_1xFPGA1_U_VoltageAmplifier2.1)
GPIO_3: F2/IO (P1_F2_IO.13), U_VoltageAmplifier_1xFPGA2/U_VoltageAmplifier2 (R28_U_VoltageAmplifier_1xFPGA2_U_VoltageAmplifier2.1)
GPIO_3: F3/IO (P1_F3_IO.13), U_VoltageAmplifier_1xFPGA3/U_VoltageAmplifier2 (R28_U_VoltageAmplifier_1xFPGA3_U_VoltageAmplifier2.1)
GPIO_3: F4/IO (P1_F4_IO.13), U_VoltageAmplifier_1xFPGA4/U_VoltageAmplifier2 (R28_U_VoltageAmplifier_1xFPGA4_U_VoltageAmplifier2.1)
GPIO_4: F1/IO (P1_F1_IO.10), U_VoltageAmplifier_1xFPGA1/U_VoltageAmplifier3 (R26_U_VoltageAmplifier_1xFPGA1_U_VoltageAmplifier3.1)
GPIO_4: F2/IO (P1_F2_IO.10), U_VoltageAmplifier_1xFPGA2/U_VoltageAmplifier3 (R26_U_VoltageAmplifier_1xFPGA2_U_VoltageAmplifier3.1)
GPIO_4: F3/IO (P1_F3_IO.10), U_VoltageAmplifier_1xFPGA3/U_VoltageAmplifier3 (R26_U_VoltageAmplifier_1xFPGA3_U_VoltageAmplifier3.1)
GPIO_4: F4/IO (P1_F4_IO.10), U_VoltageAmplifier_1xFPGA4/U_VoltageAmplifier3 (R26_U_VoltageAmplifier_1xFPGA4_U_VoltageAmplifier3.1)
GPIO_5: F1/IO (P1_F1_IO.6), U_VoltageAmplifier_1xFPGA1/U_VoltageAmplifier3 (R28_U_VoltageAmplifier_1xFPGA1_U_VoltageAmplifier3.1)
GPIO_5: F2/IO (P1_F2_IO.6), U_VoltageAmplifier_1xFPGA2/U_VoltageAmplifier3 (R28_U_VoltageAmplifier_1xFPGA2_U_VoltageAmplifier3.1)
GPIO_5: F3/IO (P1_F3_IO.6), U_VoltageAmplifier_1xFPGA3/U_VoltageAmplifier3 (R28_U_VoltageAmplifier_1xFPGA3_U_VoltageAmplifier3.1)
GPIO_5: F4/IO (P1_F4_IO.6), U_VoltageAmplifier_1xFPGA4/U_VoltageAmplifier3 (R28_U_VoltageAmplifier_1xFPGA4_U_VoltageAmplifier3.1)
GPIO_6: F1/IO (P1_F1_IO.7), U_VoltageAmplifier_1xFPGA1/U_VoltageAmplifier4 (R26_U_VoltageAmplifier_1xFPGA1_U_VoltageAmplifier4.1)
GPIO_6: F2/IO (P1_F2_IO.7), U_VoltageAmplifier_1xFPGA2/U_VoltageAmplifier4 (R26_U_VoltageAmplifier_1xFPGA2_U_VoltageAmplifier4.1)
GPIO_6: F3/IO (P1_F3_IO.7), U_VoltageAmplifier_1xFPGA3/U_VoltageAmplifier4 (R26_U_VoltageAmplifier_1xFPGA3_U_VoltageAmplifier4.1)
GPIO_6: F4/IO (P1_F4_IO.7), U_VoltageAmplifier_1xFPGA4/U_VoltageAmplifier4 (R26_U_VoltageAmplifier_1xFPGA4_U_VoltageAmplifier4.1)
GPIO_7: F1/IO (P1_F1_IO.8), U_VoltageAmplifier_1xFPGA1/U_VoltageAmplifier4 (R28_U_VoltageAmplifier_1xFPGA1_U_VoltageAmplifier4.1)
GPIO_7: F2/IO (P1_F2_IO.8), U_VoltageAmplifier_1xFPGA2/U_VoltageAmplifier4 (R28_U_VoltageAmplifier_1xFPGA2_U_VoltageAmplifier4.1)
GPIO_7: F3/IO (P1_F3_IO.8), U_VoltageAmplifier_1xFPGA3/U_VoltageAmplifier4 (R28_U_VoltageAmplifier_1xFPGA3_U_VoltageAmplifier4.1)
GPIO_7: F4/IO (P1_F4_IO.8), U_VoltageAmplifier_1xFPGA4/U_VoltageAmplifier4 (R28_U_VoltageAmplifier_1xFPGA4_U_VoltageAmplifier4.1)
GPIO_8: F1/IO (P1_F1_IO.141), U_VoltageAmplifier_1xFPGA1/U_VoltageAmplifier5 (R26_U_VoltageAmplifier_1xFPGA1_U_VoltageAmplifier5.1)
GPIO_8: F2/IO (P1_F2_IO.141), U_VoltageAmplifier_1xFPGA2/U_VoltageAmplifier5 (R26_U_VoltageAmplifier_1xFPGA2_U_VoltageAmplifier5.1)
GPIO_8: F3/IO (P1_F3_IO.141), U_VoltageAmplifier_1xFPGA3/U_VoltageAmplifier5 (R26_U_VoltageAmplifier_1xFPGA3_U_VoltageAmplifier5.1)
GPIO_8: F4/IO (P1_F4_IO.141), U_VoltageAmplifier_1xFPGA4/U_VoltageAmplifier5 (R26_U_VoltageAmplifier_1xFPGA4_U_VoltageAmplifier5.1)
GPIO_9: F1/IO (P1_F1_IO.132), U_VoltageAmplifier_1xFPGA1/U_VoltageAmplifier5 (R28_U_VoltageAmplifier_1xFPGA1_U_VoltageAmplifier5.1)
GPIO_9: F2/IO (P1_F2_IO.132), U_VoltageAmplifier_1xFPGA2/U_VoltageAmplifier5 (R28_U_VoltageAmplifier_1xFPGA2_U_VoltageAmplifier5.1)
GPIO_9: F3/IO (P1_F3_IO.132), U_VoltageAmplifier_1xFPGA3/U_VoltageAmplifier5 (R28_U_VoltageAmplifier_1xFPGA3_U_VoltageAmplifier5.1)
GPIO_9: F4/IO (P1_F4_IO.132), U_VoltageAmplifier_1xFPGA4/U_VoltageAmplifier5 (R28_U_VoltageAmplifier_1xFPGA4_U_VoltageAmplifier5.1)
GPIO_10: F1/IO (P1_F1_IO.135), U_VoltageAmplifier_1xFPGA1/U_VoltageAmplifier6 (R26_U_VoltageAmplifier_1xFPGA1_U_VoltageAmplifier6.1)
GPIO_10: F2/IO (P1_F2_IO.135), U_VoltageAmplifier_1xFPGA2/U_VoltageAmplifier6 (R26_U_VoltageAmplifier_1xFPGA2_U_VoltageAmplifier6.1)
GPIO_10: F3/IO (P1_F3_IO.135), U_VoltageAmplifier_1xFPGA3/U_VoltageAmplifier6 (R26_U_VoltageAmplifier_1xFPGA3_U_VoltageAmplifier6.1)
GPIO_10: F4/IO (P1_F4_IO.135), U_VoltageAmplifier_1xFPGA4/U_VoltageAmplifier6 (R26_U_VoltageAmplifier_1xFPGA4_U_VoltageAmplifier6.1)
GPIO_11: F1/IO (P1_F1_IO.140), U_VoltageAmplifier_1xFPGA1/U_VoltageAmplifier6 (R28_U_VoltageAmplifier_1xFPGA1_U_VoltageAmplifier6.1)
GPIO_11: F2/IO (P1_F2_IO.140), U_VoltageAmplifier_1xFPGA2/U_VoltageAmplifier6 (R28_U_VoltageAmplifier_1xFPGA2_U_VoltageAmplifier6.1)
GPIO_11: F3/IO (P1_F3_IO.140), U_VoltageAmplifier_1xFPGA3/U_VoltageAmplifier6 (R28_U_VoltageAmplifier_1xFPGA3_U_VoltageAmplifier6.1)
GPIO_11: F4/IO (P1_F4_IO.140), U_VoltageAmplifier_1xFPGA4/U_VoltageAmplifier6 (R28_U_VoltageAmplifier_1xFPGA4_U_VoltageAmplifier6.1)
GPIO_12: F1/IO (P1_F1_IO.131), U_VoltageAmplifier_1xFPGA1/U_VoltageAmplifier7 (R26_U_VoltageAmplifier_1xFPGA1_U_VoltageAmplifier7.1)
GPIO_12: F2/IO (P1_F2_IO.131), U_VoltageAmplifier_1xFPGA2/U_VoltageAmplifier7 (R26_U_VoltageAmplifier_1xFPGA2_U_VoltageAmplifier7.1)
GPIO_12: F3/IO (P1_F3_IO.131), U_VoltageAmplifier_1xFPGA3/U_VoltageAmplifier7 (R26_U_VoltageAmplifier_1xFPGA3_U_VoltageAmplifier7.1)
GPIO_12: F4/IO (P1_F4_IO.131), U_VoltageAmplifier_1xFPGA4/U_VoltageAmplifier7 (R26_U_VoltageAmplifier_1xFPGA4_U_VoltageAmplifier7.1)
GPIO_13: F1/IO (P1_F1_IO.124), U_VoltageAmplifier_1xFPGA1/U_VoltageAmplifier7 (R28_U_VoltageAmplifier_1xFPGA1_U_VoltageAmplifier7.1)
GPIO_13: F2/IO (P1_F2_IO.124), U_VoltageAmplifier_1xFPGA2/U_VoltageAmplifier7 (R28_U_VoltageAmplifier_1xFPGA2_U_VoltageAmplifier7.1)
GPIO_13: F3/IO (P1_F3_IO.124), U_VoltageAmplifier_1xFPGA3/U_VoltageAmplifier7 (R28_U_VoltageAmplifier_1xFPGA3_U_VoltageAmplifier7.1)
GPIO_13: F4/IO (P1_F4_IO.124), U_VoltageAmplifier_1xFPGA4/U_VoltageAmplifier7 (R28_U_VoltageAmplifier_1xFPGA4_U_VoltageAmplifier7.1)
GPIO_14: F1/IO (P1_F1_IO.127), U_VoltageAmplifier_1xFPGA1/U_VoltageAmplifier8 (R26_U_VoltageAmplifier_1xFPGA1_U_VoltageAmplifier8.1)
GPIO_14: F2/IO (P1_F2_IO.127), U_VoltageAmplifier_1xFPGA2/U_VoltageAmplifier8 (R26_U_VoltageAmplifier_1xFPGA2_U_VoltageAmplifier8.1)
GPIO_14: F3/IO (P1_F3_IO.127), U_VoltageAmplifier_1xFPGA3/U_VoltageAmplifier8 (R26_U_VoltageAmplifier_1xFPGA3_U_VoltageAmplifier8.1)
GPIO_14: F4/IO (P1_F4_IO.127), U_VoltageAmplifier_1xFPGA4/U_VoltageAmplifier8 (R26_U_VoltageAmplifier_1xFPGA4_U_VoltageAmplifier8.1)
GPIO_15: F1/IO (P1_F1_IO.130), U_VoltageAmplifier_1xFPGA1/U_VoltageAmplifier8 (R28_U_VoltageAmplifier_1xFPGA1_U_VoltageAmplifier8.1)
GPIO_15: F2/IO (P1_F2_IO.130), U_VoltageAmplifier_1xFPGA2/U_VoltageAmplifier8 (R28_U_VoltageAmplifier_1xFPGA2_U_VoltageAmplifier8.1)
GPIO_15: F3/IO (P1_F3_IO.130), U_VoltageAmplifier_1xFPGA3/U_VoltageAmplifier8 (R28_U_VoltageAmplifier_1xFPGA3_U_VoltageAmplifier8.1)
GPIO_15: F4/IO (P1_F4_IO.130), U_VoltageAmplifier_1xFPGA4/U_VoltageAmplifier8 (R28_U_VoltageAmplifier_1xFPGA4_U_VoltageAmplifier8.1)
GPIO_16: F1/IO (P1_F1_IO.120), U_VoltageAmplifier_1xFPGA1/U_VoltageAmplifier9 (R26_U_VoltageAmplifier_1xFPGA1_U_VoltageAmplifier9.1)
GPIO_16: F2/IO (P1_F2_IO.120), U_VoltageAmplifier_1xFPGA2/U_VoltageAmplifier9 (R26_U_VoltageAmplifier_1xFPGA2_U_VoltageAmplifier9.1)
GPIO_16: F3/IO (P1_F3_IO.120), U_VoltageAmplifier_1xFPGA3/U_VoltageAmplifier9 (R26_U_VoltageAmplifier_1xFPGA3_U_VoltageAmplifier9.1)
GPIO_16: F4/IO (P1_F4_IO.120), U_VoltageAmplifier_1xFPGA4/U_VoltageAmplifier9 (R26_U_VoltageAmplifier_1xFPGA4_U_VoltageAmplifier9.1)
GPIO_17: F1/IO (P1_F1_IO.114), U_VoltageAmplifier_1xFPGA1/U_VoltageAmplifier9 (R28_U_VoltageAmplifier_1xFPGA1_U_VoltageAmplifier9.1)
GPIO_17: F2/IO (P1_F2_IO.114), U_VoltageAmplifier_1xFPGA2/U_VoltageAmplifier9 (R28_U_VoltageAmplifier_1xFPGA2_U_VoltageAmplifier9.1)
GPIO_17: F3/IO (P1_F3_IO.114), U_VoltageAmplifier_1xFPGA3/U_VoltageAmplifier9 (R28_U_VoltageAmplifier_1xFPGA3_U_VoltageAmplifier9.1)
GPIO_17: F4/IO (P1_F4_IO.114), U_VoltageAmplifier_1xFPGA4/U_VoltageAmplifier9 (R28_U_VoltageAmplifier_1xFPGA4_U_VoltageAmplifier9.1)
GPIO_18: F1/IO (P1_F1_IO.118), U_VoltageAmplifier_1xFPGA1/U_VoltageAmplifier10 (R26_U_VoltageAmplifier_1xFPGA1_U_VoltageAmplifier10.1)
GPIO_18: F2/IO (P1_F2_IO.118), U_VoltageAmplifier_1xFPGA2/U_VoltageAmplifier10 (R26_U_VoltageAmplifier_1xFPGA2_U_VoltageAmplifier10.1)
GPIO_18: F3/IO (P1_F3_IO.118), U_VoltageAmplifier_1xFPGA3/U_VoltageAmplifier10 (R26_U_VoltageAmplifier_1xFPGA3_U_VoltageAmplifier10.1)
GPIO_18: F4/IO (P1_F4_IO.118), U_VoltageAmplifier_1xFPGA4/U_VoltageAmplifier10 (R26_U_VoltageAmplifier_1xFPGA4_U_VoltageAmplifier10.1)
GPIO_19: F1/IO (P1_F1_IO.119), U_VoltageAmplifier_1xFPGA1/U_VoltageAmplifier10 (R28_U_VoltageAmplifier_1xFPGA1_U_VoltageAmplifier10.1)
GPIO_19: F2/IO (P1_F2_IO.119), U_VoltageAmplifier_1xFPGA2/U_VoltageAmplifier10 (R28_U_VoltageAmplifier_1xFPGA2_U_VoltageAmplifier10.1)
GPIO_19: F3/IO (P1_F3_IO.119), U_VoltageAmplifier_1xFPGA3/U_VoltageAmplifier10 (R28_U_VoltageAmplifier_1xFPGA3_U_VoltageAmplifier10.1)
GPIO_19: F4/IO (P1_F4_IO.119), U_VoltageAmplifier_1xFPGA4/U_VoltageAmplifier10 (R28_U_VoltageAmplifier_1xFPGA4_U_VoltageAmplifier10.1)
GPIO_20: F1/IO (P1_F1_IO.113), U_VoltageAmplifier_1xFPGA1/U_VoltageAmplifier11 (R26_U_VoltageAmplifier_1xFPGA1_U_VoltageAmplifier11.1)
GPIO_20: F2/IO (P1_F2_IO.113), U_VoltageAmplifier_1xFPGA2/U_VoltageAmplifier11 (R26_U_VoltageAmplifier_1xFPGA2_U_VoltageAmplifier11.1)
GPIO_20: F3/IO (P1_F3_IO.113), U_VoltageAmplifier_1xFPGA3/U_VoltageAmplifier11 (R26_U_VoltageAmplifier_1xFPGA3_U_VoltageAmplifier11.1)
GPIO_20: F4/IO (P1_F4_IO.113), U_VoltageAmplifier_1xFPGA4/U_VoltageAmplifier11 (R26_U_VoltageAmplifier_1xFPGA4_U_VoltageAmplifier11.1)
GPIO_21: F1/IO (P1_F1_IO.106), U_VoltageAmplifier_1xFPGA1/U_VoltageAmplifier11 (R28_U_VoltageAmplifier_1xFPGA1_U_VoltageAmplifier11.1)
GPIO_21: F2/IO (P1_F2_IO.106), U_VoltageAmplifier_1xFPGA2/U_VoltageAmplifier11 (R28_U_VoltageAmplifier_1xFPGA2_U_VoltageAmplifier11.1)
GPIO_21: F3/IO (P1_F3_IO.106), U_VoltageAmplifier_1xFPGA3/U_VoltageAmplifier11 (R28_U_VoltageAmplifier_1xFPGA3_U_VoltageAmplifier11.1)
GPIO_21: F4/IO (P1_F4_IO.106), U_VoltageAmplifier_1xFPGA4/U_VoltageAmplifier11 (R28_U_VoltageAmplifier_1xFPGA4_U_VoltageAmplifier11.1)
GPIO_22: F1/IO (P1_F1_IO.110), U_VoltageAmplifier_1xFPGA1/U_VoltageAmplifier12 (R26_U_VoltageAmplifier_1xFPGA1_U_VoltageAmplifier12.1)
GPIO_22: F2/IO (P1_F2_IO.110), U_VoltageAmplifier_1xFPGA2/U_VoltageAmplifier12 (R26_U_VoltageAmplifier_1xFPGA2_U_VoltageAmplifier12.1)
GPIO_22: F3/IO (P1_F3_IO.110), U_VoltageAmplifier_1xFPGA3/U_VoltageAmplifier12 (R26_U_VoltageAmplifier_1xFPGA3_U_VoltageAmplifier12.1)
GPIO_22: F4/IO (P1_F4_IO.110), U_VoltageAmplifier_1xFPGA4/U_VoltageAmplifier12 (R26_U_VoltageAmplifier_1xFPGA4_U_VoltageAmplifier12.1)
GPIO_23: F1/IO (P1_F1_IO.111), U_VoltageAmplifier_1xFPGA1/U_VoltageAmplifier12 (R28_U_VoltageAmplifier_1xFPGA1_U_VoltageAmplifier12.1)
GPIO_23: F2/IO (P1_F2_IO.111), U_VoltageAmplifier_1xFPGA2/U_VoltageAmplifier12 (R28_U_VoltageAmplifier_1xFPGA2_U_VoltageAmplifier12.1)
GPIO_23: F3/IO (P1_F3_IO.111), U_VoltageAmplifier_1xFPGA3/U_VoltageAmplifier12 (R28_U_VoltageAmplifier_1xFPGA3_U_VoltageAmplifier12.1)
GPIO_23: F4/IO (P1_F4_IO.111), U_VoltageAmplifier_1xFPGA4/U_VoltageAmplifier12 (R28_U_VoltageAmplifier_1xFPGA4_U_VoltageAmplifier12.1)
GPIO_24: F1/IO (P1_F1_IO.105), U_VoltageAmplifier_1xFPGA1/U_VoltageAmplifier13 (R26_U_VoltageAmplifier_1xFPGA1_U_VoltageAmplifier13.1)
GPIO_24: F2/IO (P1_F2_IO.105), U_VoltageAmplifier_1xFPGA2/U_VoltageAmplifier13 (R26_U_VoltageAmplifier_1xFPGA2_U_VoltageAmplifier13.1)
GPIO_24: F3/IO (P1_F3_IO.105), U_VoltageAmplifier_1xFPGA3/U_VoltageAmplifier13 (R26_U_VoltageAmplifier_1xFPGA3_U_VoltageAmplifier13.1)
GPIO_24: F4/IO (P1_F4_IO.105), U_VoltageAmplifier_1xFPGA4/U_VoltageAmplifier13 (R26_U_VoltageAmplifier_1xFPGA4_U_VoltageAmplifier13.1)
GPIO_25: F1/IO (P1_F1_IO.100), U_VoltageAmplifier_1xFPGA1/U_VoltageAmplifier13 (R28_U_VoltageAmplifier_1xFPGA1_U_VoltageAmplifier13.1)
GPIO_25: F2/IO (P1_F2_IO.100), U_VoltageAmplifier_1xFPGA2/U_VoltageAmplifier13 (R28_U_VoltageAmplifier_1xFPGA2_U_VoltageAmplifier13.1)
GPIO_25: F3/IO (P1_F3_IO.100), U_VoltageAmplifier_1xFPGA3/U_VoltageAmplifier13 (R28_U_VoltageAmplifier_1xFPGA3_U_VoltageAmplifier13.1)
GPIO_25: F4/IO (P1_F4_IO.100), U_VoltageAmplifier_1xFPGA4/U_VoltageAmplifier13 (R28_U_VoltageAmplifier_1xFPGA4_U_VoltageAmplifier13.1)
GPIO_26: F1/IO (P1_F1_IO.101), U_VoltageAmplifier_1xFPGA1/U_VoltageAmplifier14 (R26_U_VoltageAmplifier_1xFPGA1_U_VoltageAmplifier14.1)
GPIO_26: F2/IO (P1_F2_IO.101), U_VoltageAmplifier_1xFPGA2/U_VoltageAmplifier14 (R26_U_VoltageAmplifier_1xFPGA2_U_VoltageAmplifier14.1)
GPIO_26: F3/IO (P1_F3_IO.101), U_VoltageAmplifier_1xFPGA3/U_VoltageAmplifier14 (R26_U_VoltageAmplifier_1xFPGA3_U_VoltageAmplifier14.1)
GPIO_26: F4/IO (P1_F4_IO.101), U_VoltageAmplifier_1xFPGA4/U_VoltageAmplifier14 (R26_U_VoltageAmplifier_1xFPGA4_U_VoltageAmplifier14.1)
GPIO_27: F1/IO (P1_F1_IO.102), U_VoltageAmplifier_1xFPGA1/U_VoltageAmplifier14 (R28_U_VoltageAmplifier_1xFPGA1_U_VoltageAmplifier14.1)
GPIO_27: F2/IO (P1_F2_IO.102), U_VoltageAmplifier_1xFPGA2/U_VoltageAmplifier14 (R28_U_VoltageAmplifier_1xFPGA2_U_VoltageAmplifier14.1)
GPIO_27: F3/IO (P1_F3_IO.102), U_VoltageAmplifier_1xFPGA3/U_VoltageAmplifier14 (R28_U_VoltageAmplifier_1xFPGA3_U_VoltageAmplifier14.1)
GPIO_27: F4/IO (P1_F4_IO.102), U_VoltageAmplifier_1xFPGA4/U_VoltageAmplifier14 (R28_U_VoltageAmplifier_1xFPGA4_U_VoltageAmplifier14.1)
GPIO_28: F1/IO (P1_F1_IO.99), U_VoltageAmplifier_1xFPGA1/U_VoltageAmplifier15 (R26_U_VoltageAmplifier_1xFPGA1_U_VoltageAmplifier15.1)
GPIO_28: F2/IO (P1_F2_IO.99), U_VoltageAmplifier_1xFPGA2/U_VoltageAmplifier15 (R26_U_VoltageAmplifier_1xFPGA2_U_VoltageAmplifier15.1)
GPIO_28: F3/IO (P1_F3_IO.99), U_VoltageAmplifier_1xFPGA3/U_VoltageAmplifier15 (R26_U_VoltageAmplifier_1xFPGA3_U_VoltageAmplifier15.1)
GPIO_28: F4/IO (P1_F4_IO.99), U_VoltageAmplifier_1xFPGA4/U_VoltageAmplifier15 (R26_U_VoltageAmplifier_1xFPGA4_U_VoltageAmplifier15.1)
GPIO_29: F1/IO (P1_F1_IO.91), U_VoltageAmplifier_1xFPGA1/U_VoltageAmplifier15 (R28_U_VoltageAmplifier_1xFPGA1_U_VoltageAmplifier15.1)
GPIO_29: F2/IO (P1_F2_IO.91), U_VoltageAmplifier_1xFPGA2/U_VoltageAmplifier15 (R28_U_VoltageAmplifier_1xFPGA2_U_VoltageAmplifier15.1)
GPIO_29: F3/IO (P1_F3_IO.91), U_VoltageAmplifier_1xFPGA3/U_VoltageAmplifier15 (R28_U_VoltageAmplifier_1xFPGA3_U_VoltageAmplifier15.1)
GPIO_29: F4/IO (P1_F4_IO.91), U_VoltageAmplifier_1xFPGA4/U_VoltageAmplifier15 (R28_U_VoltageAmplifier_1xFPGA4_U_VoltageAmplifier15.1)
GPIO_30: F1/IO (P1_F1_IO.92), U_VoltageAmplifier_1xFPGA1/U_VoltageAmplifier16 (R26_U_VoltageAmplifier_1xFPGA1_U_VoltageAmplifier16.1)
GPIO_30: F2/IO (P1_F2_IO.92), U_VoltageAmplifier_1xFPGA2/U_VoltageAmplifier16 (R26_U_VoltageAmplifier_1xFPGA2_U_VoltageAmplifier16.1)
GPIO_30: F3/IO (P1_F3_IO.92), U_VoltageAmplifier_1xFPGA3/U_VoltageAmplifier16 (R26_U_VoltageAmplifier_1xFPGA3_U_VoltageAmplifier16.1)
GPIO_30: F4/IO (P1_F4_IO.92), U_VoltageAmplifier_1xFPGA4/U_VoltageAmplifier16 (R26_U_VoltageAmplifier_1xFPGA4_U_VoltageAmplifier16.1)
GPIO_31: F1/IO (P1_F1_IO.93), U_VoltageAmplifier_1xFPGA1/U_VoltageAmplifier16 (R28_U_VoltageAmplifier_1xFPGA1_U_VoltageAmplifier16.1)
GPIO_31: F2/IO (P1_F2_IO.93), U_VoltageAmplifier_1xFPGA2/U_VoltageAmplifier16 (R28_U_VoltageAmplifier_1xFPGA2_U_VoltageAmplifier16.1)
GPIO_31: F3/IO (P1_F3_IO.93), U_VoltageAmplifier_1xFPGA3/U_VoltageAmplifier16 (R28_U_VoltageAmplifier_1xFPGA3_U_VoltageAmplifier16.1)
GPIO_31: F4/IO (P1_F4_IO.93), U_VoltageAmplifier_1xFPGA4/U_VoltageAmplifier16 (R28_U_VoltageAmplifier_1xFPGA4_U_VoltageAmplifier16.1)
GPIO_32: F1/IO (P1_F1_IO.90), U_VoltageAmplifier_1xFPGA1/U_VoltageAmplifier17 (R26_U_VoltageAmplifier_1xFPGA1_U_VoltageAmplifier17.1)
GPIO_32: F2/IO (P1_F2_IO.90), U_VoltageAmplifier_1xFPGA2/U_VoltageAmplifier17 (R26_U_VoltageAmplifier_1xFPGA2_U_VoltageAmplifier17.1)
GPIO_32: F3/IO (P1_F3_IO.90), U_VoltageAmplifier_1xFPGA3/U_VoltageAmplifier17 (R26_U_VoltageAmplifier_1xFPGA3_U_VoltageAmplifier17.1)
GPIO_32: F4/IO (P1_F4_IO.90), U_VoltageAmplifier_1xFPGA4/U_VoltageAmplifier17 (R26_U_VoltageAmplifier_1xFPGA4_U_VoltageAmplifier17.1)
GPIO_33: F1/IO (P1_F1_IO.87), U_VoltageAmplifier_1xFPGA1/U_VoltageAmplifier17 (R28_U_VoltageAmplifier_1xFPGA1_U_VoltageAmplifier17.1)
GPIO_33: F2/IO (P1_F2_IO.87), U_VoltageAmplifier_1xFPGA2/U_VoltageAmplifier17 (R28_U_VoltageAmplifier_1xFPGA2_U_VoltageAmplifier17.1)
GPIO_33: F3/IO (P1_F3_IO.87), U_VoltageAmplifier_1xFPGA3/U_VoltageAmplifier17 (R28_U_VoltageAmplifier_1xFPGA3_U_VoltageAmplifier17.1)
GPIO_33: F4/IO (P1_F4_IO.87), U_VoltageAmplifier_1xFPGA4/U_VoltageAmplifier17 (R28_U_VoltageAmplifier_1xFPGA4_U_VoltageAmplifier17.1)
GPIO_34: F1/IO (P1_F1_IO.88), U_VoltageAmplifier_1xFPGA1/U_VoltageAmplifier18 (R26_U_VoltageAmplifier_1xFPGA1_U_VoltageAmplifier18.1)
GPIO_34: F2/IO (P1_F2_IO.88), U_VoltageAmplifier_1xFPGA2/U_VoltageAmplifier18 (R26_U_VoltageAmplifier_1xFPGA2_U_VoltageAmplifier18.1)
GPIO_34: F3/IO (P1_F3_IO.88), U_VoltageAmplifier_1xFPGA3/U_VoltageAmplifier18 (R26_U_VoltageAmplifier_1xFPGA3_U_VoltageAmplifier18.1)
GPIO_34: F4/IO (P1_F4_IO.88), U_VoltageAmplifier_1xFPGA4/U_VoltageAmplifier18 (R26_U_VoltageAmplifier_1xFPGA4_U_VoltageAmplifier18.1)
GPIO_35: F1/IO (P1_F1_IO.89), U_VoltageAmplifier_1xFPGA1/U_VoltageAmplifier18 (R28_U_VoltageAmplifier_1xFPGA1_U_VoltageAmplifier18.1)
GPIO_35: F2/IO (P1_F2_IO.89), U_VoltageAmplifier_1xFPGA2/U_VoltageAmplifier18 (R28_U_VoltageAmplifier_1xFPGA2_U_VoltageAmplifier18.1)
GPIO_35: F3/IO (P1_F3_IO.89), U_VoltageAmplifier_1xFPGA3/U_VoltageAmplifier18 (R28_U_VoltageAmplifier_1xFPGA3_U_VoltageAmplifier18.1)
GPIO_35: F4/IO (P1_F4_IO.89), U_VoltageAmplifier_1xFPGA4/U_VoltageAmplifier18 (R28_U_VoltageAmplifier_1xFPGA4_U_VoltageAmplifier18.1)
GPIO_36: F1/IO (P1_F1_IO.86), U_VoltageAmplifier_1xFPGA1/U_VoltageAmplifier19 (R26_U_VoltageAmplifier_1xFPGA1_U_VoltageAmplifier19.1)
GPIO_36: F2/IO (P1_F2_IO.86), U_VoltageAmplifier_1xFPGA2/U_VoltageAmplifier19 (R26_U_VoltageAmplifier_1xFPGA2_U_VoltageAmplifier19.1)
GPIO_36: F3/IO (P1_F3_IO.86), U_VoltageAmplifier_1xFPGA3/U_VoltageAmplifier19 (R26_U_VoltageAmplifier_1xFPGA3_U_VoltageAmplifier19.1)
GPIO_36: F4/IO (P1_F4_IO.86), U_VoltageAmplifier_1xFPGA4/U_VoltageAmplifier19 (R26_U_VoltageAmplifier_1xFPGA4_U_VoltageAmplifier19.1)
GPIO_37: F1/IO (P1_F1_IO.85), U_VoltageAmplifier_1xFPGA1/U_VoltageAmplifier19 (R28_U_VoltageAmplifier_1xFPGA1_U_VoltageAmplifier19.1)
GPIO_37: F2/IO (P1_F2_IO.85), U_VoltageAmplifier_1xFPGA2/U_VoltageAmplifier19 (R28_U_VoltageAmplifier_1xFPGA2_U_VoltageAmplifier19.1)
GPIO_37: F3/IO (P1_F3_IO.85), U_VoltageAmplifier_1xFPGA3/U_VoltageAmplifier19 (R28_U_VoltageAmplifier_1xFPGA3_U_VoltageAmplifier19.1)
GPIO_37: F4/IO (P1_F4_IO.85), U_VoltageAmplifier_1xFPGA4/U_VoltageAmplifier19 (R28_U_VoltageAmplifier_1xFPGA4_U_VoltageAmplifier19.1)
GPIO_38: F1/IO (P1_F1_IO.25), U_VoltageAmplifier_1xFPGA1/U_VoltageAmplifier20 (R26_U_VoltageAmplifier_1xFPGA1_U_VoltageAmplifier20.1)
GPIO_38: F2/IO (P1_F2_IO.25), U_VoltageAmplifier_1xFPGA2/U_VoltageAmplifier20 (R26_U_VoltageAmplifier_1xFPGA2_U_VoltageAmplifier20.1)
GPIO_38: F3/IO (P1_F3_IO.25), U_VoltageAmplifier_1xFPGA3/U_VoltageAmplifier20 (R26_U_VoltageAmplifier_1xFPGA3_U_VoltageAmplifier20.1)
GPIO_38: F4/IO (P1_F4_IO.25), U_VoltageAmplifier_1xFPGA4/U_VoltageAmplifier20 (R26_U_VoltageAmplifier_1xFPGA4_U_VoltageAmplifier20.1)
GPIO_39: F1/IO (P1_F1_IO.21), U_VoltageAmplifier_1xFPGA1/U_VoltageAmplifier20 (R28_U_VoltageAmplifier_1xFPGA1_U_VoltageAmplifier20.1)
GPIO_39: F2/IO (P1_F2_IO.21), U_VoltageAmplifier_1xFPGA2/U_VoltageAmplifier20 (R28_U_VoltageAmplifier_1xFPGA2_U_VoltageAmplifier20.1)
GPIO_39: F3/IO (P1_F3_IO.21), U_VoltageAmplifier_1xFPGA3/U_VoltageAmplifier20 (R28_U_VoltageAmplifier_1xFPGA3_U_VoltageAmplifier20.1)
GPIO_39: F4/IO (P1_F4_IO.21), U_VoltageAmplifier_1xFPGA4/U_VoltageAmplifier20 (R28_U_VoltageAmplifier_1xFPGA4_U_VoltageAmplifier20.1)
GPIO_40: F1/IO (P1_F1_IO.22), U_VoltageAmplifier_1xFPGA1/U_VoltageAmplifier21 (R26_U_VoltageAmplifier_1xFPGA1_U_VoltageAmplifier21.1)
GPIO_40: F2/IO (P1_F2_IO.22), U_VoltageAmplifier_1xFPGA2/U_VoltageAmplifier21 (R26_U_VoltageAmplifier_1xFPGA2_U_VoltageAmplifier21.1)
GPIO_40: F3/IO (P1_F3_IO.22), U_VoltageAmplifier_1xFPGA3/U_VoltageAmplifier21 (R26_U_VoltageAmplifier_1xFPGA3_U_VoltageAmplifier21.1)
GPIO_40: F4/IO (P1_F4_IO.22), U_VoltageAmplifier_1xFPGA4/U_VoltageAmplifier21 (R26_U_VoltageAmplifier_1xFPGA4_U_VoltageAmplifier21.1)
GPIO_41: F1/IO (P1_F1_IO.24), U_VoltageAmplifier_1xFPGA1/U_VoltageAmplifier21 (R28_U_VoltageAmplifier_1xFPGA1_U_VoltageAmplifier21.1)
GPIO_41: F2/IO (P1_F2_IO.24), U_VoltageAmplifier_1xFPGA2/U_VoltageAmplifier21 (R28_U_VoltageAmplifier_1xFPGA2_U_VoltageAmplifier21.1)
GPIO_41: F3/IO (P1_F3_IO.24), U_VoltageAmplifier_1xFPGA3/U_VoltageAmplifier21 (R28_U_VoltageAmplifier_1xFPGA3_U_VoltageAmplifier21.1)
GPIO_41: F4/IO (P1_F4_IO.24), U_VoltageAmplifier_1xFPGA4/U_VoltageAmplifier21 (R28_U_VoltageAmplifier_1xFPGA4_U_VoltageAmplifier21.1)
GPIO_42: F1/IO (P1_F1_IO.39), U_VoltageAmplifier_1xFPGA1/U_VoltageAmplifier22 (R26_U_VoltageAmplifier_1xFPGA1_U_VoltageAmplifier22.1)
GPIO_42: F2/IO (P1_F2_IO.39), U_VoltageAmplifier_1xFPGA2/U_VoltageAmplifier22 (R26_U_VoltageAmplifier_1xFPGA2_U_VoltageAmplifier22.1)
GPIO_42: F3/IO (P1_F3_IO.39), U_VoltageAmplifier_1xFPGA3/U_VoltageAmplifier22 (R26_U_VoltageAmplifier_1xFPGA3_U_VoltageAmplifier22.1)
GPIO_42: F4/IO (P1_F4_IO.39), U_VoltageAmplifier_1xFPGA4/U_VoltageAmplifier22 (R26_U_VoltageAmplifier_1xFPGA4_U_VoltageAmplifier22.1)
GPIO_43: F1/IO (P1_F1_IO.28), U_VoltageAmplifier_1xFPGA1/U_VoltageAmplifier22 (R28_U_VoltageAmplifier_1xFPGA1_U_VoltageAmplifier22.1)
GPIO_43: F2/IO (P1_F2_IO.28), U_VoltageAmplifier_1xFPGA2/U_VoltageAmplifier22 (R28_U_VoltageAmplifier_1xFPGA2_U_VoltageAmplifier22.1)
GPIO_43: F3/IO (P1_F3_IO.28), U_VoltageAmplifier_1xFPGA3/U_VoltageAmplifier22 (R28_U_VoltageAmplifier_1xFPGA3_U_VoltageAmplifier22.1)
GPIO_43: F4/IO (P1_F4_IO.28), U_VoltageAmplifier_1xFPGA4/U_VoltageAmplifier22 (R28_U_VoltageAmplifier_1xFPGA4_U_VoltageAmplifier22.1)
GPIO_44: F1/IO (P1_F1_IO.29), U_VoltageAmplifier_1xFPGA1/U_VoltageAmplifier23 (R26_U_VoltageAmplifier_1xFPGA1_U_VoltageAmplifier23.1)
GPIO_44: F2/IO (P1_F2_IO.29), U_VoltageAmplifier_1xFPGA2/U_VoltageAmplifier23 (R26_U_VoltageAmplifier_1xFPGA2_U_VoltageAmplifier23.1)
GPIO_44: F3/IO (P1_F3_IO.29), U_VoltageAmplifier_1xFPGA3/U_VoltageAmplifier23 (R26_U_VoltageAmplifier_1xFPGA3_U_VoltageAmplifier23.1)
GPIO_44: F4/IO (P1_F4_IO.29), U_VoltageAmplifier_1xFPGA4/U_VoltageAmplifier23 (R26_U_VoltageAmplifier_1xFPGA4_U_VoltageAmplifier23.1)
GPIO_45: F1/IO (P1_F1_IO.38), U_VoltageAmplifier_1xFPGA1/U_VoltageAmplifier23 (R28_U_VoltageAmplifier_1xFPGA1_U_VoltageAmplifier23.1)
GPIO_45: F2/IO (P1_F2_IO.38), U_VoltageAmplifier_1xFPGA2/U_VoltageAmplifier23 (R28_U_VoltageAmplifier_1xFPGA2_U_VoltageAmplifier23.1)
GPIO_45: F3/IO (P1_F3_IO.38), U_VoltageAmplifier_1xFPGA3/U_VoltageAmplifier23 (R28_U_VoltageAmplifier_1xFPGA3_U_VoltageAmplifier23.1)
GPIO_45: F4/IO (P1_F4_IO.38), U_VoltageAmplifier_1xFPGA4/U_VoltageAmplifier23 (R28_U_VoltageAmplifier_1xFPGA4_U_VoltageAmplifier23.1)
GPIO_46: F1/IO (P1_F1_IO.45), U_VoltageAmplifier_1xFPGA1/U_VoltageAmplifier24 (R26_U_VoltageAmplifier_1xFPGA1_U_VoltageAmplifier24.1)
GPIO_46: F2/IO (P1_F2_IO.45), U_VoltageAmplifier_1xFPGA2/U_VoltageAmplifier24 (R26_U_VoltageAmplifier_1xFPGA2_U_VoltageAmplifier24.1)
GPIO_46: F3/IO (P1_F3_IO.45), U_VoltageAmplifier_1xFPGA3/U_VoltageAmplifier24 (R26_U_VoltageAmplifier_1xFPGA3_U_VoltageAmplifier24.1)
GPIO_46: F4/IO (P1_F4_IO.45), U_VoltageAmplifier_1xFPGA4/U_VoltageAmplifier24 (R26_U_VoltageAmplifier_1xFPGA4_U_VoltageAmplifier24.1)
GPIO_47: F1/IO (P1_F1_IO.41), U_VoltageAmplifier_1xFPGA1/U_VoltageAmplifier24 (R28_U_VoltageAmplifier_1xFPGA1_U_VoltageAmplifier24.1)
GPIO_47: F2/IO (P1_F2_IO.41), U_VoltageAmplifier_1xFPGA2/U_VoltageAmplifier24 (R28_U_VoltageAmplifier_1xFPGA2_U_VoltageAmplifier24.1)